# EAGLE design hike data logger (EAGLE 5.11)
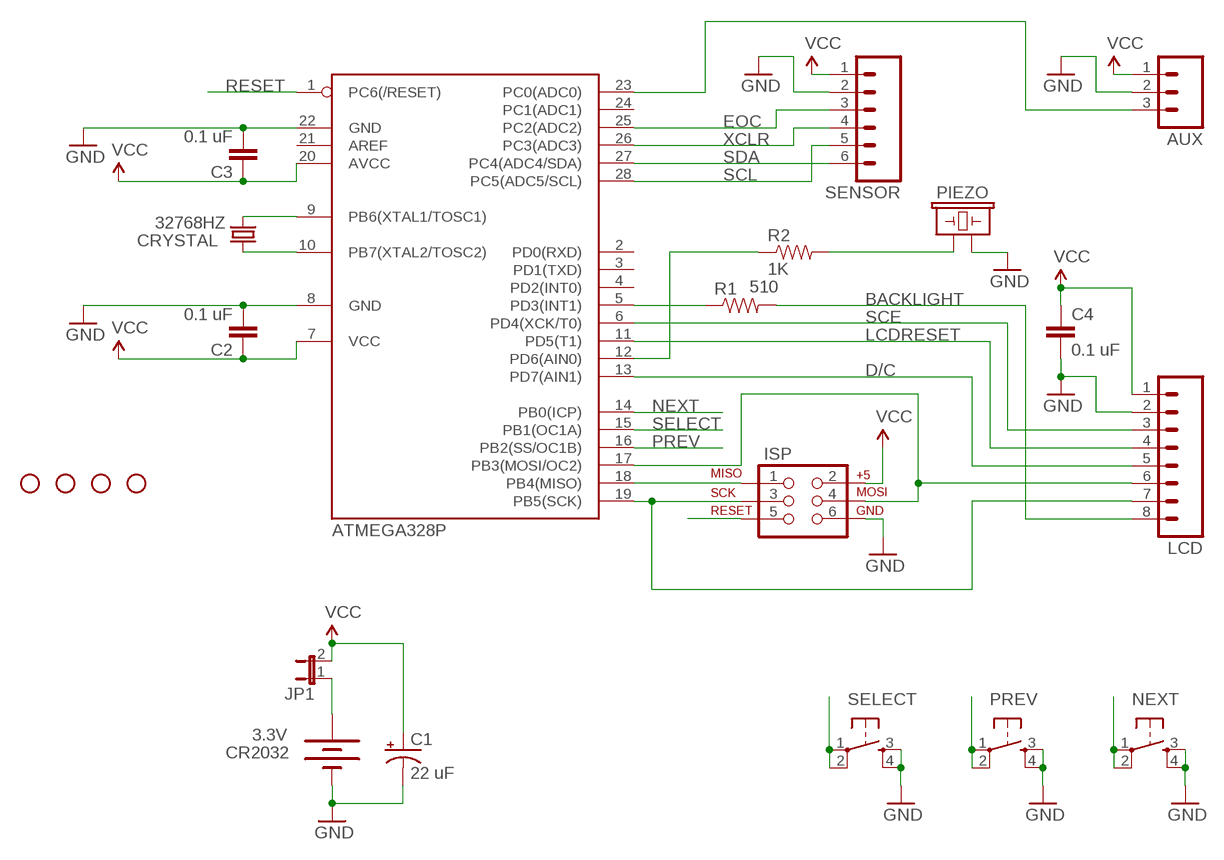
[diagram p0: schematic, sheet 1]

## Parts
ATMEGA328P  MEGA8-P  [DIL28-3]
AUX  M03PTH  [1X03]
C1  22 uF  CAP_POLPTH2  [CPOL-RADIAL-10UF-25V]
C2  0.1 uF  CAPPTH1  [CAP-PTH-5MM]
C3  0.1 uF  CAPPTH1  [CAP-PTH-5MM]
C4  0.1 uF  CAPPTH1  [CAP-PTH-5MM]
CR2032  3.3V  BATTERY20PTH  [BATTCOM_20MM_PTH]
CRYSTAL  32768HZ  CRYSTALTC38H  [TC38H]
ISP  AVR_SPI_PRG_6PTH  [2X3]
JP1  JUMPER-2PTH  [1X02]
JP2  STAND-OFF  [STAND-OFF]
JP3  STAND-OFF  [STAND-OFF]
JP4  STAND-OFF  [STAND-OFF]
JP5  STAND-OFF  [STAND-OFF]
LCD  M081X08  [1X08]
NEXT  TAC_SWITCHPTH  [TACTILE-PTH]
PIEZO  BUZZERPTH-5MM  [BUZZER-12.6MM]
PREV  TAC_SWITCHPTH  [TACTILE-PTH]
R1  510  RESISTORKIT  [AXIAL-0.3-KIT]
R2  1K  RESISTORKIT  [AXIAL-0.3-KIT]
SELECT  TAC_SWITCHPTH  [TACTILE-PTH]
SENSOR  M06SIP  [1X06]

## Nets
BACKLIGHT: LCD.8 R1.P$2
D/C: ATMEGA328P.13(PD7(AIN1)) LCD.5
EOC: ATMEGA328P.25(PC2(ADC2)) SENSOR.3
GND: ATMEGA328P.8(GND) ATMEGA328P.22(GND) AUX.2 C1.2(-) C2.2 C3.2 C4.2 CR2032.2(-) ISP.6 LCD.2 NEXT.3 NEXT.4 PIEZO.- PREV.3 PREV.4 SELECT.3 SELECT.4 SENSOR.2
LCDRESET: ATMEGA328P.11(PD5(T1)) LCD.4
N$1: ATMEGA328P.9(PB6(XTAL1/TOSC1)) CRYSTAL.2
N$2: ATMEGA328P.10(PB7(XTAL2/TOSC2)) CRYSTAL.1
N$3: ATMEGA328P.12(PD6(AIN0)) R2.P$1
N$7: ATMEGA328P.19(PB5(SCK)) ISP.3 LCD.7
N$8: ATMEGA328P.18(PB4(MISO)) ISP.1
N$9: ATMEGA328P.17(PB3(MOSI/OC2)) ISP.4 LCD.6
N$10: PIEZO.+ R2.P$2
N$11: ATMEGA328P.5(PD3(INT1)) R1.P$1
N$19: CR2032.1(+) JP1.1
N$20: ATMEGA328P.23(PC0(ADC0)) AUX.3
NEXT: ATMEGA328P.14(PB0(ICP)) NEXT.1 NEXT.2
PREV: ATMEGA328P.16(PB2(SS/OC1B)) PREV.1 PREV.2
RESET: ATMEGA328P.1(PC6(/RESET)) ISP.5
SCE: ATMEGA328P.6(PD4(XCK/T0)) LCD.3
SCL: ATMEGA328P.28(PC5(ADC5/SCL)) SENSOR.5
SDA: ATMEGA328P.27(PC4(ADC4/SDA)) SENSOR.6
SELECT: ATMEGA328P.15(PB1(OC1A)) SELECT.1 SELECT.2
VCC: ATMEGA328P.7(VCC) ATMEGA328P.20(AVCC) AUX.1 C1.1(+) C2.1 C3.1 C4.1 ISP.2 JP1.2 LCD.1 SENSOR.1
XCLR: ATMEGA328P.26(PC3(ADC3)) SENSOR.4
Unconnected: ATMEGA328P.2(PD0(RXD)) ATMEGA328P.3(PD1(TXD)) ATMEGA328P.4(PD2(INT0)) ATMEGA328P.21(AREF) ATMEGA328P.24(PC1(ADC1))

## Library data of the parts
ATMEGA328P = atmel:MEGA8-P: MICROCONTROLLER 8 Kbytes FLASH, 1 kbytes SRAM, 512 bytes EEPROM, USART, 4-channel 10 bit ADC, 2-channel 8 bit ADC Pin compatible with Atmega48, ATMega88, ATMega168 Source: avr.lbr; OC_FARNELL: unknown; OC_NEWARK: unknown
AUX = SparkFun:M03: Header 3 Standard 3-pin 0.1" header. Use with straight break away headers (SKU : PRT-00116), right angle break away headers (PRT-00553), swiss pins (PRT-00743), machine pins (PRT-00117), and female headers (PRT-00115). Molex polarized connector foot print use with SKU : PRT-08232 with associated crimp pins and housings.
C1 = SparkFun:CAP_POL: Capacitor Polarized These are standard SMD and PTH capacitors. Normally 10uF, 47uF, and 100uF in electrolytic and tantalum varieties. Always verify the external diameter of the through hole cap, it varies with capacity, voltage, and manufacturer. The EIA devices should be standard.
C2-C4 = SparkFun:CAP: Capacitor Standard 0603 ceramic capacitor, and 0.1" leaded capacitor.
CR2032 = SparkFun:BATTERY: Battery Holders Various common sizes : AA, AAA, 20mm coin cell and 12mm coin cell.
CRYSTAL = SparkFun:CRYSTAL: Crystals Various standard crystals. Proven footprints. Spark Fun Electronics SKU : COM-00534
ISP = SparkFun:AVR_SPI_PRG_6: AVR ISP 6 Pin This is the reduced ISP connector for AVR programming. Common on Arduino. This footprint will take up less PCB space and can be used with a 10-pin to 6-pin adapter such as SKU: BOB-08508
JP1 = SparkFun:JUMPER-2: Jumper Basic 0.1" spaced jumper. Use with breakaway headers.
JP2-JP5 = SparkFun:STAND-OFF: Stand Off This is the mechanical footprint for a #4 phillips button head screw. Use the keepout ring to avoid running the screw head into surrounding components. SKU : PRT-00447
LCD = SparkFun:M08: Header 8 Standard 8-pin 0.1" header. Use with straight break away headers (SKU : PRT-00116), right angle break away headers (PRT-00553), swiss pins (PRT-00743), machine pins (PRT-00117), and female headers (PRT-00115).
NEXT PREV SELECT = SparkFun:TAC_SWITCH: Momentary Switch Button commonly used for reset or general input. Spark Fun Electronics SKU : COM-00097
PIEZO = SparkFun:BUZZER: Buzzer 12mm Spark Fun Electronics SKU : Comp-Buzzer
R1 R2 = SparkFun:RESISTOR: Resistor Basic schematic elements and footprints for 0603, 1206, and PTH resistors.
SENSOR = SparkFun:M06: Header 6 Standard 6-pin 0.1" header. Use with straight break away headers (SKU : PRT-00116), right angle break away headers (PRT-00553), swiss pins (PRT-00743), machine pins (PRT-00117), and female headers (PRT-00115). Molex polarized connector foot print use with SKU : PRT-08094 with associated crimp pins and housings. NOTES ON THE VARIANTS LOCK and LOCK_LONGPADS... This footprint was designed to help hold the alignment of a through-hole component (i.e. 6-pin header) while soldering it into place. You may notice that each hole has been shifted either up or down by 0.005 of an inch from it's more standard position (which is a perfectly straight line). This slight alteration caused the pins (the squares in the middle) to touch the edges of the holes. Because they are alternating, it causes a "brace" to hold the component in place. 0.005 has proven to be the perfect amount of "off-center" position when using our standard breakaway headers. Although looks a little odd when you look at the bare footprint, once you have a header in there, the alteration is very hard to notice. Also, if you push a header all the way into place, it is covered up entirely on the bottom side. This idea of altering the position of holes to aid alignment will be further integrated into the Sparkfun Library for other footprints. It can help hold any component with 3 or more connection pins.

## Board
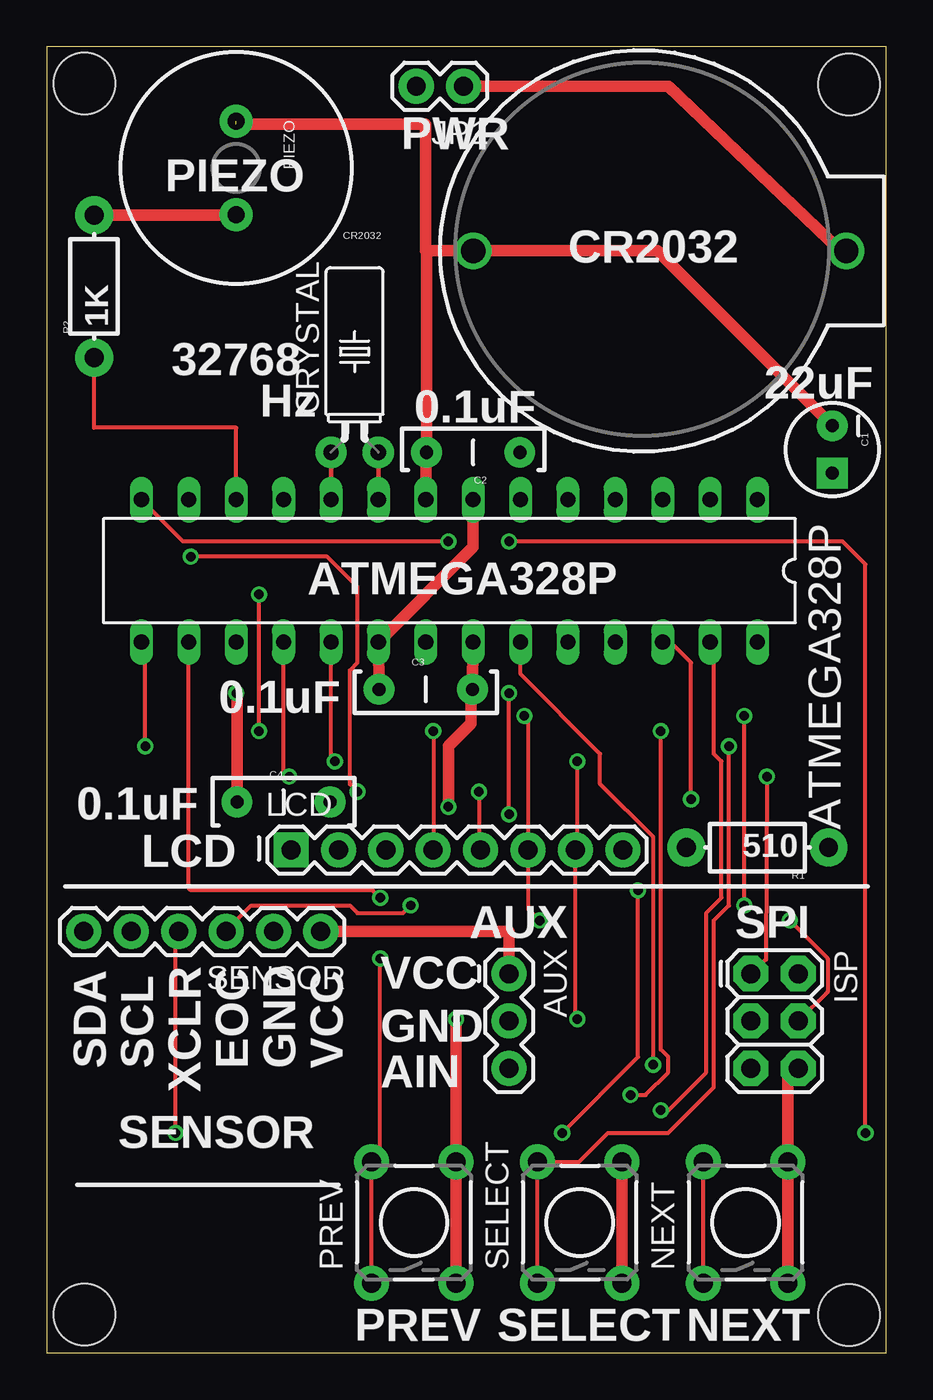
[diagram p1: board, top side]
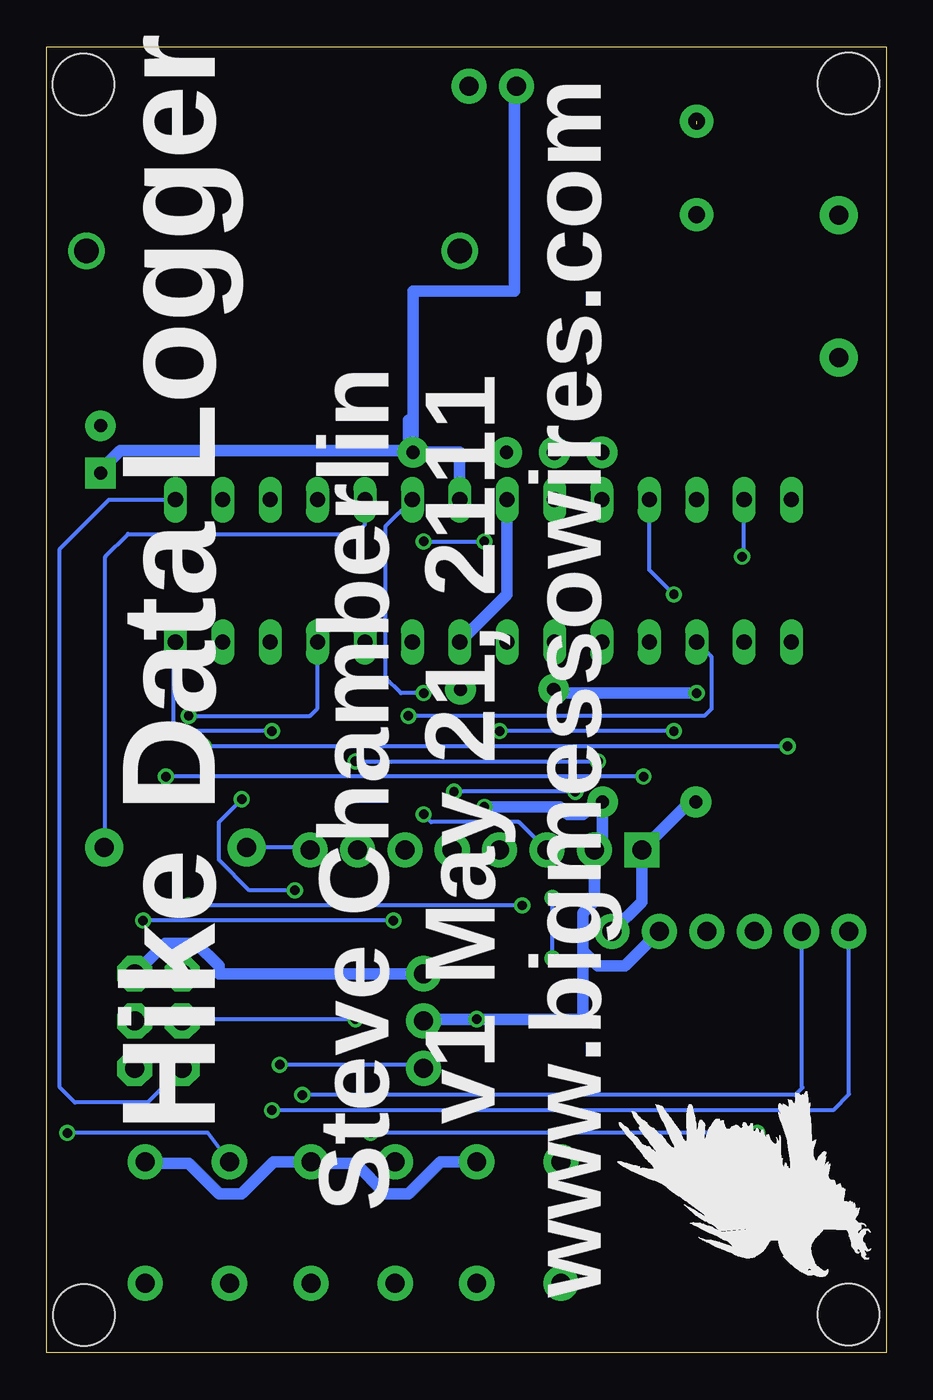
[diagram p2: board, bottom side, seen from below]

Size 45 x 70 mm. Coordinates in mm from the lower left corner, seen from the top.
Outline: 0,0 45,0 45,70 0,70 0,0
Copper layers (1*16): Top 0.0356mm / dielectric 1.5011mm / Bottom 0.0356mm
Design rules "LaenPCBOrder": minimum track width 6mil, minimum drill 13mil, track to track 6mil, track to pad 6mil, pad to pad 6mil, via to via 6mil, smd to smd 6mil, copper to edge 15mil, drill to drill 6mil, minimum pad ring 7mil, minimum via ring 7mil, stop-mask expansion 4mil, vias tented up to drill 0mil, thermal gap 10mil

### Footprints (pad centres in the part's own frame; a part is rotated, then mirrored left to right if it is on the bottom)
DIL28-3 = drill 0.813 long: 1 -16.51,-3.81; 2 -13.97,-3.81; 3 -11.43,-3.81; 4 -8.89,-3.81; 5 -6.35,-3.81; 6 -3.81,-3.81; 7 -1.27,-3.81; 8 1.27,-3.81; 9 3.81,-3.81; 10 6.35,-3.81; 11 8.89,-3.81; 12 11.43,-3.81; 13 13.97,-3.81; 14 16.51,-3.81; 15 16.51,3.81; 16 13.97,3.81; 17 11.43,3.81; 18 8.89,3.81; 19 6.35,3.81; 20 3.81,3.81; 21 1.27,3.81; 22 -1.27,3.81; 23 -3.81,3.81; 24 -6.35,3.81; 25 -8.89,3.81; 26 -11.43,3.81; 27 -13.97,3.81; 28 -16.51,3.81
1X03 = drill 1.016 pad 1.88 round: 1 0,0; 2 2.54,0; 3 5.08,0
CPOL-RADIAL-10UF-25V = drill 0.7 pad 1.651 square: 1 1.27,0 | drill 0.7 pad 1.651 round: 2 -1.27,0
CAP-PTH-5MM = drill 0.7 pad 1.651 round: 1 -2.5,0; 2 2.5,0
BATTCOM_20MM_PTH = drill 1.3 round: 1 20,0; 2 0,0
TC38H = drill 0.813 pad 1.676 round: 1 -1.27,0; 2 1.27,0
2X3 = drill 1.016 pad 1.88 octagon: 1 0,0; 2 0,2.54; 3 2.54,0; 4 2.54,2.54; 5 5.08,0; 6 5.08,2.54
1X02 = drill 1.016 pad 1.88 round: 1 0,0; 2 2.54,0
STAND-OFF = hole 3.302: 0,0
1X08 = drill 1.016 pad 1.88 square: 1 0,0 | drill 1.016 pad 1.88 round: 2 2.54,0; 3 5.08,0; 4 7.62,0; 5 10.16,0; 6 12.7,0; 7 15.24,0; 8 17.78,0
TACTILE-PTH = drill 1.016 pad 1.88 round: 1 -3.251,2.261; 2 3.251,2.261; 3 -3.251,-2.261; 4 3.251,-2.261
BUZZER-12.6MM = drill 0.9 pad 1.778 round: + 2.5,0; - -2.5,0
AXIAL-0.3-KIT = drill 1.016 pad 2.032 round: P$1 -3.81,0; P$2 3.81,0
1X06 = drill 1.016 pad 1.88 round: 1 0,0; 2 2.54,0; 3 5.08,0; 4 7.62,0; 5 10.16,0; 6 12.7,0

### Placement (x,y rotation side)
ATMEGA328P  21.59,41.91 180 top
AUX  24.79,20.32 270 top
C1  42.11,48.41 270 top
C2  22.86,48.26 180 top
C3  20.32,35.56 0 top
C4  12.7,29.53 0 top
CR2032  22.86,59.05 0 top
CRYSTAL  16.51,48.26 0 top
ISP  37.74,20.32 270 top
JP1  22.35,67.87 180 top
JP2  2.03,68.02 0 top
JP3  43.02,67.96 0 top
JP4  43,2.02 0 top
JP5  2.03,2.05 0 top
LCD  13.1,26.94 0 top
NEXT  37.47,6.99 90 top
PIEZO  10.16,63.5 270 top
PREV  19.68,6.99 90 top
R1  38.1,27.08 180 top
R2  2.54,57.15 90 top
SELECT  28.57,6.99 90 top
SENSOR  14.7,22.58 180 top
U$1  [EAGLE-PLC-10MM]  0.81,4.06 90 bottom

### Tracks (layer width: path | path; a pad name or v marks a point on that pad's centre or on a via)
BACKLIGHT
  Bottom 0.203: R1.P$2 31.02,27.08 LCD.8
D/C  (via drill 0.51)
  Top 0.203: v7.72,42.67 15.04,42.67 16.66,41.05 16.66,36.98 16.26,36.58 16.26,30.48 v16.66,30.07 | v23.16,30.07 23.16,27.04 LCD.5
  Bottom 0.203: ATMEGA328P.13 7.62,42.77 v7.72,42.67 | v16.66,30.07 v23.16,30.07
EOC  (via drill 0.51)
  Top 0.203: SENSOR.3 9.62,22.62 10.97,23.98 16.26,23.98 16.66,23.57 19.1,23.57 v19.51,23.98 | v37.39,23.98 v37.39,34.14
  Bottom 0.203: v19.51,23.98 v37.39,23.98 | v37.39,34.14 30.89,34.14 30.48,34.54 ATMEGA328P.25
GND  (via drill 0.51)  (1 unrouted)
  Top 0.61: ATMEGA328P.22 C3.2 22.76,35.5 22.76,33.73 21.54,32.51 v21.54,29.26 | ATMEGA328P.8 C2.2 20.36,59.05 | 20.36,59.05 CR2032.2 32.74,59.05 C1.2 | 10.16,65.84 20.32,65.84 20.32,59.05 20.36,59.05 | v21.95,17.88 PREV.4 PREV.3 | SELECT.4 SELECT.3 | NEXT.3 NEXT.4 39.73,14.68 ISP.6
  Bottom 0.61: ATMEGA328P.8 20.32,40.64 ATMEGA328P.22 | 16.26,21.54 16.26,23.57 15.64,24.19 LCD.2 15.2,27.38 C4.2 15.58,29.53 16.26,28.85 17.07,28.85 17.48,29.26 v21.54,29.26 | 16.26,21.54 15.44,20.73 14.01,20.73 SENSOR.2 | 16.26,21.54 16.26,17.88 v21.95,17.88 | v21.95,17.88 24.79,17.88 AUX.2 24.69,17.88 v21.95,17.88 | PREV.4 23.9,10.24 25.6,8.53 26.82,8.53 28.45,10.16 30.76,10.16 SELECT.4 32.84,10.24 34.54,8.53 35.76,8.53 37.39,10.16 39.65,10.16 NEXT.4
LCDRESET  (via drill 0.51)
  Top 0.203: v11.38,33.33 v11.38,40.64 | v20.73,33.33 LCD.4
  Bottom 0.203: ATMEGA328P.11 12.7,41.96 v11.38,40.64 | v11.38,33.33 v20.73,33.33
N$1
  Top 0.254: ATMEGA328P.9 CRYSTAL.2
N$2
  Top 0.254: ATMEGA328P.10 CRYSTAL.1
N$3
  Top 0.203: ATMEGA328P.12 10.16,49.58 2.54,49.58 R2.P$1
N$7  (via drill 0.51)
  Top 0.203: LCD.7 28.58,26.94 | LCD.7 28.45,27.05 v28.45,31.7 | v15.44,31.7 15.24,31.9 ATMEGA328P.19 | v28.45,17.88 28.34,17.99 LCD.7
  Bottom 0.203: v28.45,31.7 v15.44,31.7 | ISP.3 37.64,17.88 v28.45,17.88
N$8  (via drill 0.51)
  Top 0.203: ISP.1 38.56,21.08 v38.61,30.89 | v13.01,30.89 12.7,31.19 ATMEGA328P.18
  Bottom 0.203: v13.01,30.89 v38.61,30.89
N$9  (via drill 0.51)
  Top 0.203: ISP.4 41.86,19.36 41.86,21.13 v39.83,23.16 | v26.42,23.16 25.8,23.78 LCD.6 25.8,33.94 v25.6,34.14
  Bottom 0.203: v26.42,23.16 v39.83,23.16 | v25.6,34.14 9.75,34.14 9.35,34.54 9.35,37.29 ATMEGA328P.17
N$10
  Top 0.61: R2.P$2 10.12,60.96 PIEZO.+
N$11
  Bottom 0.203: ATMEGA328P.5 27.94,44.4 28.45,43.89 40.64,43.89 41.86,42.67 41.86,27.13 R1.P$1
N$19
  Top 0.61: CR2032.1 42.55,59.05 33.33,67.87 JP1.1
N$20  (via drill 0.51)
  Top 0.203: v32.51,15.44 32.51,27.64 29.67,30.48 29.67,32.11 25.4,36.37 ATMEGA328P.23
  Bottom 0.203: AUX.3 24.99,15.44 v32.51,15.44
NEXT  (via drill 0.51)
  Top 0.203: NEXT.1 NEXT.2 | v43.89,11.79 43.89,42.27 42.67,43.48 v24.79,43.48 | v21.54,43.48 7.32,43.48 ATMEGA328P.14
  Bottom 0.203: NEXT.2 36.35,11.79 v43.89,11.79 | v24.79,43.48 v21.54,43.48
PREV  (via drill 0.51)
  Top 0.203: PREV.1 PREV.2 17.88,10.69 v17.88,21.13 | v17.88,24.38 17.48,24.79 7.72,24.79 7.62,24.89 ATMEGA328P.16
  Bottom 0.203: v17.88,21.13 v17.88,24.38
RESET
  Bottom 0.203: ATMEGA328P.1 41.66,45.72 44.3,43.08 44.3,14.22 43.48,13.41 39.57,13.41 ISP.5
SCE  (via drill 0.51)
  Top 0.203: v24.79,28.85 v24.79,35.36
  Bottom 0.203: ATMEGA328P.6 26.82,44.3 26.82,36.17 26.01,35.36 v24.79,35.36 | LCD.3 19.69,28.45 24.38,28.45 v24.79,28.85
SCL  (via drill 0.51)
  Top 0.203: v31.29,13.82 32.11,13.82 33.33,15.04 33.33,15.85 32.92,16.26 v32.92,33.33
  Bottom 0.203: SENSOR.5 4.54,14.29 4.47,14.22 4.88,13.82 v31.29,13.82 | v32.92,33.33 38.2,33.33 38.2,38 ATMEGA328P.28
SDA  (via drill 0.51)
  Top 0.203: v32.92,13.01 33.33,13.01 35.36,15.04 35.36,23.57 36.17,24.38 36.17,31.7 35.76,32.11 35.76,37.9 ATMEGA328P.27
  Bottom 0.203: SENSOR.6 2,13.86 2.85,13.01 v32.92,13.01
SELECT  (via drill 0.51)
  Top 0.203: SELECT.1 SELECT.2 28.52,10.24 30.07,11.79 33.33,11.79 35.76,14.22 35.76,23.16 36.58,23.98 v36.58,32.51 | v5.28,32.51 5.28,37.9 ATMEGA328P.15
  Bottom 0.203: v36.58,32.51 v5.28,32.51
VCC  (via drill 0.51)
  Top 0.61: C3.1 ATMEGA328P.20 22.86,43.18 ATMEGA328P.7 | SENSOR.1 24.79,22.58 AUX.1 | C4.1 10.2,35.32 v10.16,35.36
  Bottom 0.61: 25.6,49.99 25.6,48.26 C2.1 | C2.1 25.36,56.9 19.91,56.9 19.91,68.28 JP1.2 | ATMEGA328P.7 22.86,48.26 C2.1 | C1.1 42.11,47.3 41.05,48.36 25.46,48.36 C2.1 | C4.1 10.51,29.53 LCD.1 13.1,24.18 SENSOR.1 | AUX.1 35.76,20.32 35.76,20.73 36.98,21.95 38.66,21.95 ISP.2 | v10.16,35.36 17.62,35.36 C3.1
XCLR  (via drill 0.51)
  Top 0.203: ATMEGA328P.26 33.43,38.1 34.54,36.98 v34.54,29.67 | v31.7,24.79 31.7,15.85 v27.64,11.79 | v6.91,11.79 6.91,22.41 SENSOR.4
  Bottom 0.203: v34.54,29.67 35.76,28.45 35.76,26.42 34.14,24.79 v31.7,24.79 | v6.91,11.79 v27.64,11.79

### Text on the board
tPlace: PWR | PIEZO | CR2032 | 32768 | 22uF | Hz | 0.1uF | ATMEGA328P | 0.1uF | 0.1uF | LCD | AUX | SPI | VCC | GND | SDA | SCL | EOC | GND | VCC | XCLR | AIN | SENSOR | PREV | SELECT | NEXT
bPlace: Hike Data Logger | www.bigmessowires.com | Steve Chamberlin | v1 May 21, 2111